# EAGLE design encoder moduler (EAGLE 9.6.2)
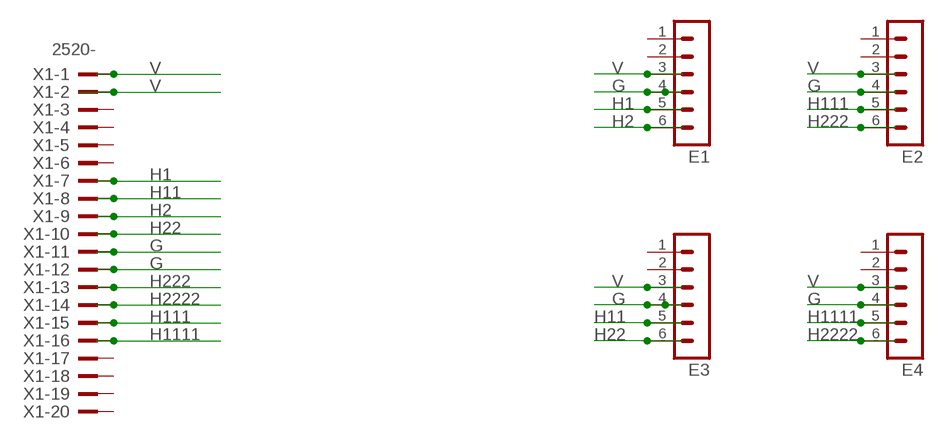
[diagram p0: schematic, sheet 1]

## Parts
E1  MA06-1  [MA06-1]
E2  MA06-1  [MA06-1]
E3  MA06-1  [MA06-1]
E4  MA06-1  [MA06-1]
X1  2520-  [PAK100/2500-20]

## Nets
G: E1.4 E2.4 E3.4 E4.4 X1.11 X1.12
H1: E1.5 X1.7
H2: E1.6 X1.9
H11: E3.5 X1.8
H22: E3.6 X1.10
H111: E2.5 X1.15
H222: E2.6 X1.13
H1111: E4.5 X1.16
H2222: E4.6 X1.14
V: E1.3 E2.3 E3.3 E4.3 X1.1 X1.2
Unconnected: E1.1 E1.2 E2.1 E2.2 E3.1 E3.2 E4.1 E4.2 X1.3 X1.4 X1.5 X1.6 X1.17 X1.18 X1.19 X1.20

## Library data of the parts
E1-E4 = con-lstb:MA06-1: PIN HEADER; OC_FARNELL: unknown; OC_NEWARK: unknown
X1 = con-3m:2520-: 3M (TM) Pak 100 4-Wall Header Source: 3M; OC_FARNELL: unknown; OC_NEWARK: unknown

## Board
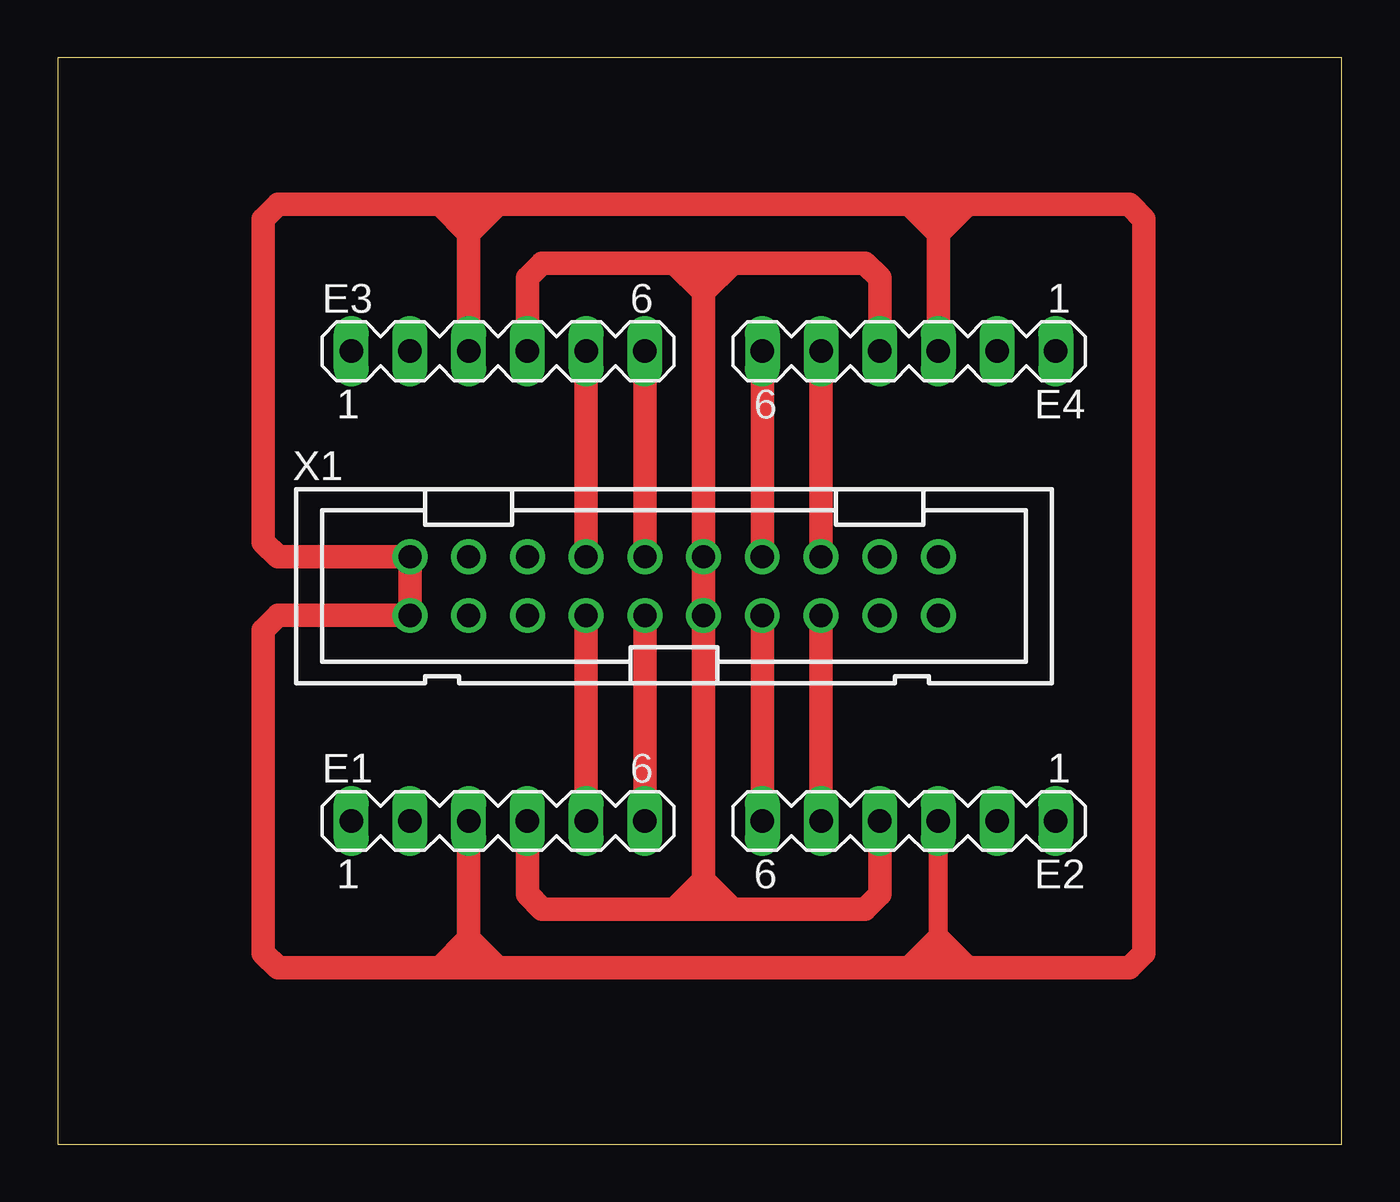
[diagram p1: board, top side]

Size 55.55 x 46.98 mm. Coordinates in mm from the lower left corner, seen from the top.
Outline: 0,0 55.55,0 55.55,46.98 0,46.98 0,0
Copper layers (1*16): Top 0.035mm / dielectric 1.5mm / Bottom 0.035mm
Design rules "default": minimum track width 6mil, minimum drill 0.35mm, track to track 6mil, track to pad 6mil, pad to pad 6mil, via to via 6mil, smd to smd 6mil, copper to edge 40mil, drill to drill 6mil, minimum pad ring 10mil, minimum via ring 8mil, stop-mask expansion 4mil, vias tented up to drill 0mil, thermal gap 10mil

### Footprints (pad centres in the part's own frame; a part is rotated, then mirrored left to right if it is on the bottom)
MA06-1 = drill 1.016 long: 1 -6.35,0; 2 -3.81,0; 3 -1.27,0; 4 1.27,0; 5 3.81,0; 6 6.35,0
PAK100/2500-20 = drill 1 pad 1.422: 1 -11.43,-1.27; 2 -11.43,1.27; 3 -8.89,-1.27; 4 -8.89,1.27; 5 -6.35,-1.27; 6 -6.35,1.27; 7 -3.81,-1.27; 8 -3.81,1.27; 9 -1.27,-1.27; 10 -1.27,1.27; 11 1.27,-1.27; 12 1.27,1.27; 13 3.81,-1.27; 14 3.81,1.27; 15 6.35,-1.27; 16 6.35,1.27; 17 8.89,-1.27; 18 8.89,1.27; 19 11.43,-1.27; 20 11.43,1.27

### Placement (x,y rotation side)
E1  19.05,13.97 0 top
E2  36.83,13.97 180 top
E3  19.05,34.29 0 top
E4  36.83,34.29 180 top
X1  26.67,24.13 0 top

### Tracks (layer width: path | path; a pad name or v marks a point on that pad's centre or on a via)
G
  Top 1.016: 29.21,10.16 34.93,10.16 35.56,10.79 E2.4 | E4.4 35.56,37.47 34.93,38.1 29.21,38.1 | 27.94,36.83 X1.11 | X1.11 27.94,11.43 | 26.67,38.1 27.94,36.83 | 27.94,36.83 29.21,38.1 | 29.21,10.16 27.94,11.43 | 27.94,11.43 26.67,10.16 | X1.12 X1.11 | 26.67,38.1 27.94,38.1 | 27.94,38.1 29.21,38.1 | 27.94,36.83 27.94,38.1 | E3.4 20.32,37.47 20.95,38.1 26.67,38.1 | 26.67,10.16 27.94,10.16 | 27.94,10.16 29.21,10.16 | 27.94,11.43 27.94,10.16 | E1.4 20.32,10.79 20.95,10.16 26.67,10.16
H1
  Top 1.016: E1.5 X1.7
H2
  Top 1.016: E1.6 X1.9
H11
  Top 1.016: E3.5 X1.8
H22
  Top 1.016: E3.6 X1.10
H111
  Top 1.016: 33.02,20.32 X1.15 E2.5
H222
  Top 1.016: 30.48,19.05 X1.13 E2.6
H1111
  Top 1.016: E4.5 X1.16
H2222
  Top 1.016: E4.6 X1.14
V
  Top 0.813: 38.1,8.89 E2.3
  Top 1.016: E1.3 17.78,8.89 | 17.78,8.89 16.51,7.62 | E3.3 17.78,39.37 | 17.78,39.37 16.51,40.64 | 36.83,7.62 19.05,7.62 | 19.05,7.62 17.78,7.62 | 17.78,7.62 16.51,7.62 | 16.51,7.62 9.52,7.62 8.89,8.25 8.89,22.22 9.52,22.86 X1.1 X1.2 9.52,25.4 8.89,26.04 8.89,40.01 9.52,40.64 16.51,40.64 | 36.83,7.62 38.1,8.89 | 16.51,40.64 17.78,40.64 | 17.78,40.64 19.05,40.64 | 19.05,40.64 36.83,40.64 | 36.83,40.64 38.1,39.37 | 38.1,39.37 E4.3 | 17.78,39.37 17.78,40.64 | 17.78,39.37 19.05,40.64 | 17.78,8.89 17.78,7.62 | 17.78,8.89 19.05,7.62 | 36.83,40.64 38.1,40.64 | 38.1,40.64 39.37,40.64 | 39.37,40.64 46.35,40.64 46.99,40.01 46.99,8.25 46.35,7.62 39.37,7.62 | 39.37,7.62 38.1,7.62 | 38.1,7.62 36.83,7.62 | 38.1,8.89 39.37,7.62 | 38.1,8.89 38.1,7.62 | 38.1,39.37 39.37,40.64 | 38.1,39.37 38.1,40.64